# Altium schematic sheet MT8365_eMMC.SchDoc
size A4; SheetNumber: 5; SheetTotal: 35
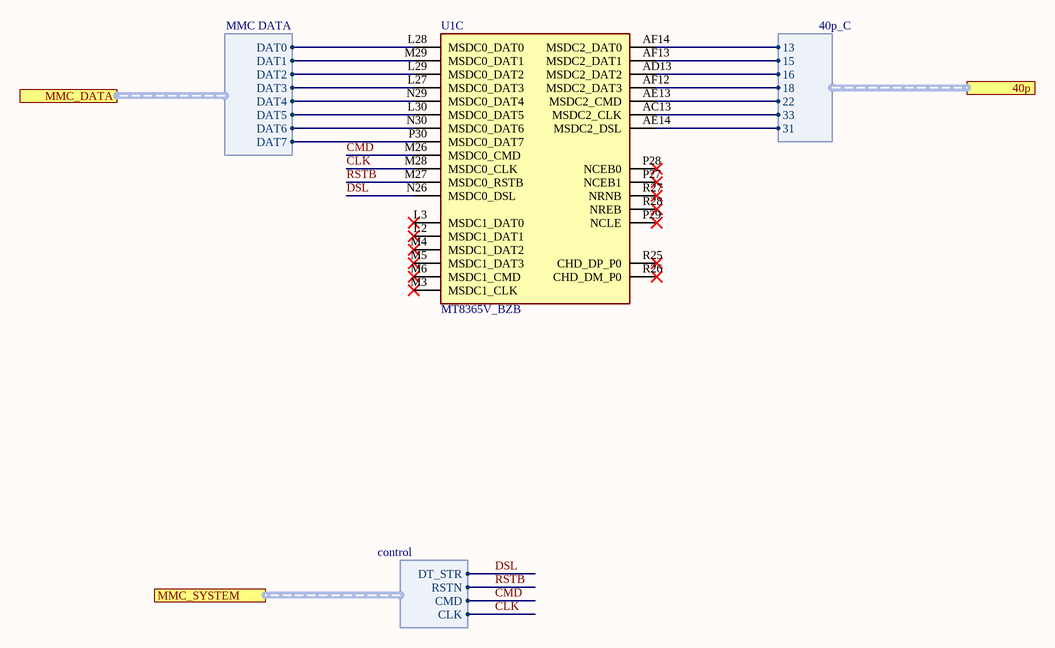
[diagram p0: MT8365_eMMC.SchDoc]

## Parts
U1  MT8365V_BZB  [BGA633C40P30X29_1220X1180X90]  (part C of 10)

## Ports
40p (harness 40p_C, see MT8365[4600,4000], GPIOs[500,5200], MT8365[4600,3000], MT8365[7500,8900], MT8365[10000,5500], MT8365_AUD[3500,5200], MT8365_CONN[10500,3000]), MMC_DATA (harness MMC DATA, see MT8365[3600,4800], eMMC[6000,4540], MT8365[2280,4800]), MMC_SYSTEM (harness control, see MT8365[3600,4300], eMMC[5900,3640], MT8365[2180,4300])

## Harnesses
MMC DATA: DAT0, DAT1, DAT2, DAT3, DAT4, DAT5, DAT6, DAT7
control: DT_STR, RSTN, CMD, CLK
40p_C: 15, 16, 18, 22, 13, 33, 31

## Nets
CLK: U1.M28(MSDC0_CLK) ; port MMC_SYSTEM.CLK
CMD: U1.M26(MSDC0_CMD) ; port MMC_SYSTEM.CMD
DSL: U1.N26(MSDC0_DSL) ; port MMC_SYSTEM.DT_STR
RSTB: U1.M27(MSDC0_RSTB) ; port MMC_SYSTEM.RSTN
NetU1_AC13: U1.AC13(MSDC2_CLK) ; port 40p.33
NetU1_AD13: U1.AD13(MSDC2_DAT2) ; port 40p.16
NetU1_AE13: U1.AE13(MSDC2_CMD) ; port 40p.22
NetU1_AE14: U1.AE14(MSDC2_DSL) ; port 40p.31
NetU1_AF12: U1.AF12(MSDC2_DAT3) ; port 40p.18
NetU1_AF13: U1.AF13(MSDC2_DAT1) ; port 40p.15
NetU1_AF14: U1.AF14(MSDC2_DAT0) ; port 40p.13
NetU1_L27: U1.L27(MSDC0_DAT3) ; port MMC_DATA.DAT3
NetU1_L28: U1.L28(MSDC0_DAT0) ; port MMC_DATA.DAT0
NetU1_L29: U1.L29(MSDC0_DAT2) ; port MMC_DATA.DAT2
NetU1_L30: U1.L30(MSDC0_DAT5) ; port MMC_DATA.DAT5
NetU1_M29: U1.M29(MSDC0_DAT1) ; port MMC_DATA.DAT1
NetU1_N29: U1.N29(MSDC0_DAT4) ; port MMC_DATA.DAT4
NetU1_N30: U1.N30(MSDC0_DAT6) ; port MMC_DATA.DAT6
NetU1_P30: U1.P30(MSDC0_DAT7) ; port MMC_DATA.DAT7

Not connected (* = marked no-connect by the designer): U1 L2(MSDC1_DAT1)* L3(MSDC1_DAT0)* M3(MSDC1_CLK)* M4(MSDC1_DAT2)* M5(MSDC1_DAT3)* M6(MSDC1_CMD)* P27(NCEB1)* P28(NCEB0)* P29(NCLE)* R25(CHD_DP_P0)* R26(CHD_DM_P0)* R27(NRNB)* R28(NREB)*

## Library data of the parts
U1 = MT8365V_BZB: SoC; Manufacturer_Name: Mediatek; Manufacturer_Part_Number: MT8365V/BZB; Datasheet Link: https://www.mouser.co.uk/datasheet/2/1074/MT8365_AIoT_Application_Processor_Datasheet_v1_0_2-3106631.pdf; Height: 0.9mm; Mouser Part Number: 840-MT8365V/BZB; Mouser Price/Stock: https://www.mouser.co.uk/ProductDetail/MediaTek/MT8365V-BZB?qs=Jm2GQyTW%2FbjcedX9ugwNWQ%3D%3D